# Altium schematic sheet 07 AD9363.SchDoc
size A3
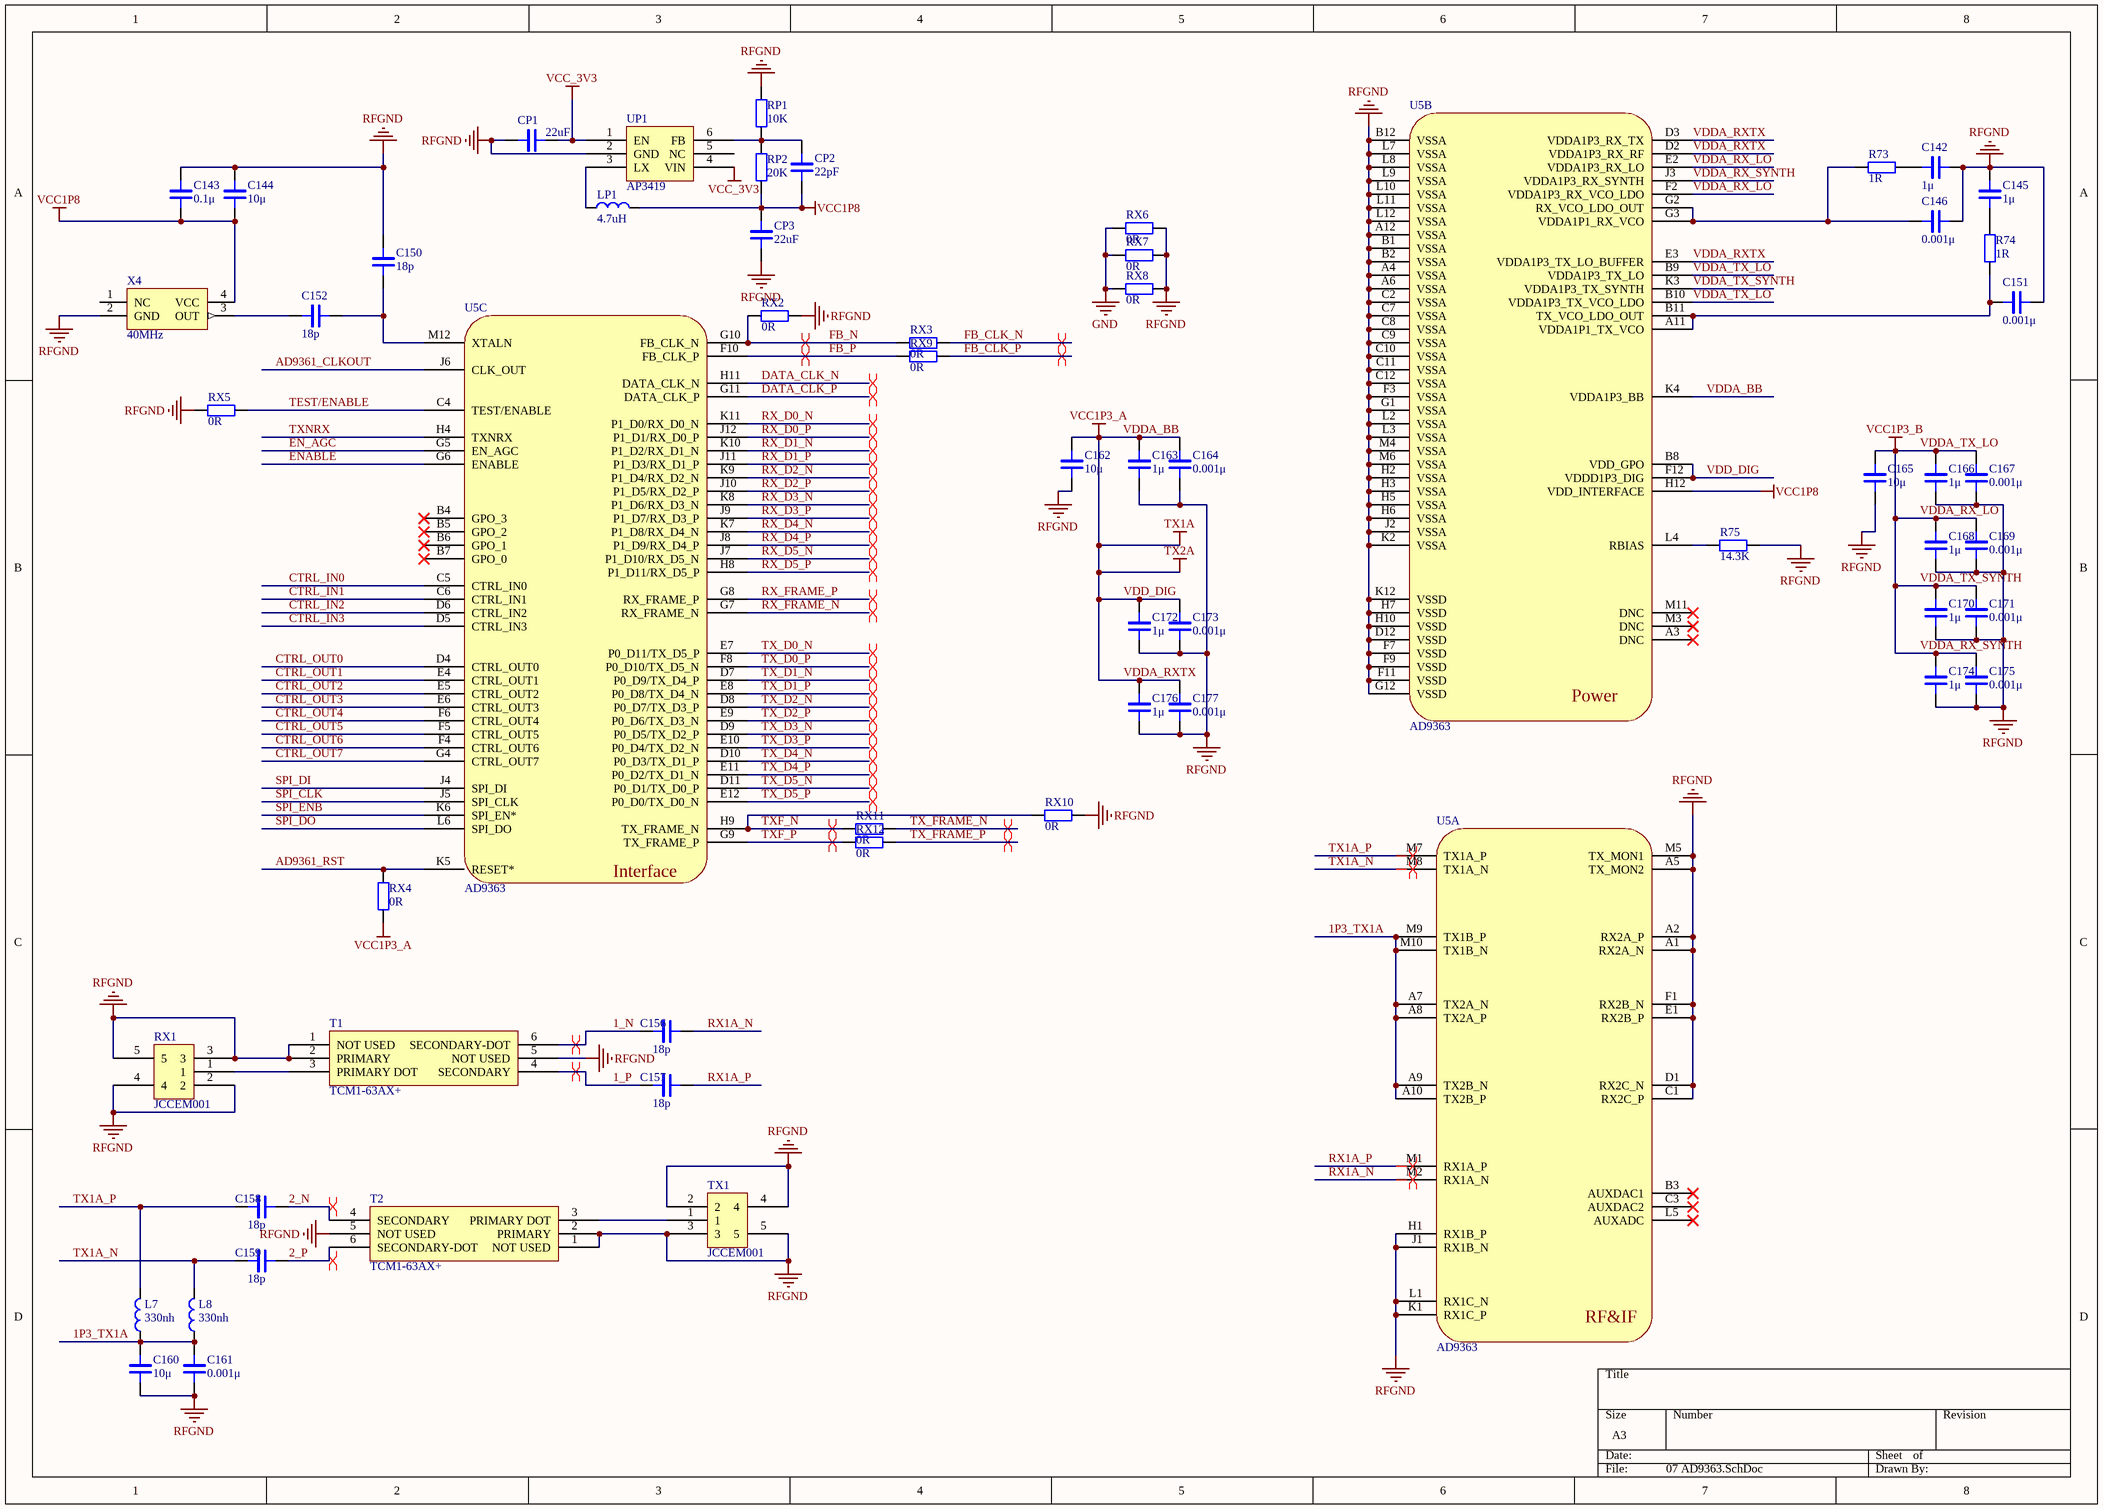
[diagram p0: 07 AD9363.SchDoc]

## Parts
C142  1μ  [LC-0402_C]
C143  0.1μ  [LC-0402_C]
C144  10μ  [LC-0402_C]
C145  1μ  [LC-0402_C]
C146  0.001μ  [LC-0402_C]
C150  18p  [LC-0402_C]
C151  0.001μ  [LC-0402_C]
C152  18p  [LC-0402_C]
C156  18p  [LC-0402_C]
C157  18p  [LC-0402_C]
C158  18p  [LC-0402_C]
C159  18p  [LC-0402_C]
C160  10μ  [LC-0402_C]
C161  0.001μ  [LC-0402_C]
C162  10μ  [LC-0402_C]
C163  1μ  [LC-0402_C]
C164  0.001μ  [LC-0402_C]
C165  10μ  [LC-0402_C]
C166  1μ  [LC-0402_C]
C167  0.001μ  [LC-0402_C]
C168  1μ  [LC-0402_C]
C169  0.001μ  [LC-0402_C]
C170  1μ  [LC-0402_C]
C171  0.001μ  [LC-0402_C]
C172  1μ  [LC-0402_C]
C173  0.001μ  [LC-0402_C]
C174  1μ  [LC-0402_C]
C175  0.001μ  [LC-0402_C]
C176  1μ  [LC-0402_C]
C177  0.001μ  [LC-0402_C]
CP1  22uF  [LC-0805_C]
CP2  22pF  [LC-0402_C]
CP3  22uF  [LC-0805_C]
L7  330nh  [LC-0603_L]
L8  330nh  [LC-0603_L]
LP1  4.7uH  [L1008]
R73  1R  [LC-0402_R]
R74  1R  [LC-0402_R]
R75  14.3K  [LC-0402_R]
RP1  10K  [LC-0402_R]
RP2  20K  [LC-0402_R]
RX1  JCCEM001  [CNSMARAL687W375H171]
RX2  0R  [LC-0402_R]
RX3  0R  [LC-0402_R]
RX4  0R  [LC-0402_R]
RX5  0R  [LC-0402_R]
RX6  0R  [LC-0603_L]
RX7  0R  [LC-0603_L]
RX8  0R  [LC-0603_L]
RX9  0R  [LC-0402_R]
RX10  0R  [LC-0402_R]
RX11  0R  [LC-0402_R]
RX12  0R  [LC-0402_R]
T1  TCM1-63AX+  [TSML150W160H160]
T2  TCM1-63AX+  [TSML150W160H160]
TX1  JCCEM001  [CNSMARAL687W375H171]
U5  AD9363  [AD936X]  (parts A,B,C of 3)
UP1  AP3419  [AP3419]
X4  40MHz  [OSC-SMD_4P-L3.2-W2.5-BL]

## Nets
GND: RX6.2 RX7.2 RX8.2
RFGND: C142.2 C143.1 C144.1 C145.1 C146.1 C150.1 C151.1 C160.2 C161.1 C162.2 C163.2 C164.2 C165.2 C166.2 C167.2 C168.2 C169.2 C170.2 C171.2 C172.2 C173.2 C174.2 C175.2 C176.2 C177.2 CP1.1 CP3.1 R75.2 RP1.2 RX1.2 RX1.3 RX1.4 RX1.5 RX2.1 RX5.1 RX6.1 RX7.1 RX8.1 RX10.1 T1.1(NOT_USED) T1.2(PRIMARY) T1.5(NOT_USED) T2.1(NOT_USED) T2.2(PRIMARY) T2.5(NOT_USED) TX1.2 TX1.3 TX1.4 TX1.5 U5.A1(RX2A_N) U5.A2(RX2A_P) U5.A4(VSSA) U5.A5(TX_MON2) U5.A6(VSSA) U5.A12(VSSA) U5.B1(VSSA) U5.B2(VSSA) U5.B12(VSSA) U5.C1(RX2C_P) U5.C2(VSSA) U5.C7(VSSA) U5.C8(VSSA) U5.C9(VSSA) U5.C10(VSSA) U5.C11(VSSA) U5.C12(VSSA) U5.D1(RX2C_N) U5.D12(VSSD) U5.E1(RX2B_P) U5.F1(RX2B_N) U5.F3(VSSA) U5.F7(VSSD) U5.F9(VSSD) U5.F11(VSSD) U5.G1(VSSA) U5.G12(VSSD) U5.H1(RX1B_P) U5.H2(VSSA) U5.H3(VSSA) U5.H5(VSSA) U5.H6(VSSA) U5.H7(VSSD) U5.H10(VSSD) U5.J1(RX1B_N) U5.J2(VSSA) U5.K1(RX1C_P) U5.K2(VSSA) U5.K12(VSSD) U5.L1(RX1C_N) U5.L2(VSSA) U5.L3(VSSA) U5.L7(VSSA) U5.L8(VSSA) U5.L9(VSSA) U5.L10(VSSA) U5.L11(VSSA) U5.L12(VSSA) U5.M4(VSSA) U5.M5(TX_MON1) U5.M6(VSSA) UP1.2(GND) X4.2(GND)
VCC1P8: C143.2 C144.2 CP2.1 CP3.2 LP1.2 RP2.1 U5.H12(VDD_INTERFACE) X4.4(VCC)
VCC_3V3: CP1.2 UP1.1(EN) UP1.4(VIN)
VDD_DIG: C162.1 C163.1 C164.1 C172.1 C173.1 C176.1 C177.1 RX4.2 U5.B8(VDD_GPO) U5.D2(VDDA1P3_RX_RF) U5.D3(VDDA1P3_RX_TX) U5.E3(VDDA1P3_TX_LO_BUFFER) U5.F12(VDDD1P3_DIG) U5.K4(VDDA1P3_BB)  [also labelled TX1A, TX2A, VCC1P3_A, VDDA_BB, VDDA_RXTX]
VDDA_RX_LO: C165.1 C166.1 C167.1 C168.1 C169.1 C170.1 C171.1 C174.1 C175.1 U5.B9(VDDA1P3_TX_LO) U5.B10(VDDA1P3_TX_VCO_LDO) U5.E2(VDDA1P3_RX_LO) U5.F2(VDDA1P3_RX_VCO_LDO) U5.J3(VDDA1P3_RX_SYNTH) U5.K3(VDDA1P3_TX_SYNTH)  [also labelled VCC1P3_B, VDDA_RX_SYNTH, VDDA_TX_LO, VDDA_TX_SYNTH]
1_N: C156.1 T1.6(SECONDARY-DOT)
1_P: C157.1 T1.4(SECONDARY)
1P3_TX1A: C160.1 C161.2 L7.1 L8.1 U5.A7(TX2A_N) U5.A8(TX2A_P) U5.A9(TX2B_N) U5.A10(TX2B_P) U5.M9(TX1B_P) U5.M10(TX1B_N)
2_N: C158.2 T2.4(SECONDARY)
2_P: C159.2 T2.6(SECONDARY-DOT)
AD9361_CLKOUT: U5.J6(CLK_OUT)
AD9361_RST: RX4.1 U5.K5(RESET*)
CTRL_IN0: U5.C5(CTRL_IN0)
CTRL_IN1: U5.C6(CTRL_IN1)
CTRL_IN2: U5.D6(CTRL_IN2)
CTRL_IN3: U5.D5(CTRL_IN3)
CTRL_OUT0: U5.D4(CTRL_OUT0)
CTRL_OUT1: U5.E4(CTRL_OUT1)
CTRL_OUT2: U5.E5(CTRL_OUT2)
CTRL_OUT3: U5.E6(CTRL_OUT3)
CTRL_OUT4: U5.F6(CTRL_OUT4)
CTRL_OUT5: U5.F5(CTRL_OUT5)
CTRL_OUT6: U5.F4(CTRL_OUT6)
CTRL_OUT7: U5.G4(CTRL_OUT7)
DATA_CLK_N: U5.H11(DATA_CLK_N)
DATA_CLK_P: U5.G11(DATA_CLK_P)
EN_AGC: U5.G5(EN_AGC)
ENABLE: U5.G6(ENABLE)
FB_CLK_N: RX3.1
FB_CLK_P: RX9.1
FB_N: RX2.2 RX3.2 U5.G10(FB_CLK_N)
FB_P: RX9.2 U5.F10(FB_CLK_P)
RX1A_N: C156.2 U5.M2(RX1A_N)
RX1A_P: C157.2 U5.M1(RX1A_P)
RX_D0_N: U5.K11(P1_D0/RX_D0_N)
RX_D0_P: U5.J12(P1_D1/RX_D0_P)
RX_D1_N: U5.K10(P1_D2/RX_D1_N)
RX_D1_P: U5.J11(P1_D3/RX_D1_P)
RX_D2_N: U5.K9(P1_D4/RX_D2_N)
RX_D2_P: U5.J10(P1_D5/RX_D2_P)
RX_D3_N: U5.K8(P1_D6/RX_D3_N)
RX_D3_P: U5.J9(P1_D7/RX_D3_P)
RX_D4_N: U5.K7(P1_D8/RX_D4_N)
RX_D4_P: U5.J8(P1_D9/RX_D4_P)
RX_D5_N: U5.J7(P1_D10/RX_D5_N)
RX_D5_P: U5.H8(P1_D11/RX_D5_P)
RX_FRAME_N: U5.G7(RX_FRAME_N)
RX_FRAME_P: U5.G8(RX_FRAME_P)
SPI_CLK: U5.J5(SPI_CLK)
SPI_DI: U5.J4(SPI_DI)
SPI_DO: U5.L6(SPI_DO)
SPI_ENB: U5.K6(SPI_EN*)
TEST/ENABLE: RX5.2 U5.C4(TEST/ENABLE)
TX1A_N: C159.1 L8.2 U5.M8(TX1A_N)
TX1A_P: C158.1 L7.2 U5.M7(TX1A_P)
TX_D0_N: U5.E7(P0_D11/TX_D5_P)
TX_D0_P: U5.F8(P0_D10/TX_D5_N)
TX_D1_N: U5.D7(P0_D9/TX_D4_P)
TX_D1_P: U5.E8(P0_D8/TX_D4_N)
TX_D2_N: U5.D8(P0_D7/TX_D3_P)
TX_D2_P: U5.E9(P0_D6/TX_D3_N)
TX_D3_N: U5.D9(P0_D5/TX_D2_P)
TX_D3_P: U5.E10(P0_D4/TX_D2_N)
TX_D4_N: U5.D10(P0_D3/TX_D1_P)
TX_D4_P: U5.E11(P0_D2/TX_D1_N)
TX_D5_N: U5.D11(P0_D1/TX_D0_P)
TX_D5_P: U5.E12(P0_D0/TX_D0_N)
TX_FRAME_N: RX11.1
TX_FRAME_P: RX12.1
TXF_N: RX10.2 RX11.2 U5.H9(TX_FRAME_N)
TXF_P: RX12.2 U5.G9(TX_FRAME_P)
TXNRX: U5.H4(TXNRX)
NetC142_1: C142.1 R73.2
NetC145_2: C145.2 R74.1
NetC146_2: C146.2 R73.1 U5.G2(RX_VCO_LDO_OUT) U5.G3(VDDA1P1_RX_VCO)
NetC150_2: C150.2 C152.1 U5.M12(XTALN)
NetC151_2: C151.2 R74.2 U5.A11(VDDA1P1_TX_VCO) U5.B11(TX_VCO_LDO_OUT)
NetC152_2: C152.2 X4.3(OUT)
NetCP2_2: CP2.2 RP1.1 RP2.2 UP1.6(FB)
NetLP1_1: LP1.1 UP1.3(LX)
NetR75_1: R75.1 U5.L4(RBIAS)
NetRX1_1: RX1.1 T1.3(PRIMARY_DOT)
NetT2_3: T2.3(PRIMARY_DOT) TX1.1

Not connected (* = marked no-connect by the designer): U5 A3(DNC)* B3(AUXDAC1)* B4(GPO_3)* B5(GPO_2)* B6(GPO_1)* B7(GPO_0)* C3(AUXDAC2)* L5(AUXADC)* M3(DNC)* M11(DNC)*; UP1 5(NC); X4 1(NC)

## Layout directives
differential pair: 1_N, 1_P, 2_N, 2_P, DATA_CLK_N, DATA_CLK_P, FB_CLK_N, FB_CLK_P, FB_N, FB_P, RX1A_N, RX1A_P, RX_D0_N, RX_D0_P, RX_D1_N, RX_D1_P, RX_D2_N, RX_D2_P, RX_D3_N, RX_D3_P, RX_D4_N, RX_D4_P, RX_D5_N, RX_D5_P, RX_FRAME_N, RX_FRAME_P, TX1A_N, TX1A_P, TX_D0_N, TX_D0_P, TX_D1_N, TX_D1_P, TX_D2_N, TX_D2_P, TX_D3_N, TX_D3_P, TX_D4_N, TX_D4_P, TX_D5_N, TX_D5_P, TX_FRAME_N, TX_FRAME_P, TXF_N, TXF_P

## Notes on the sheet
- (in symbol AD9363, part A) RF&IF
- (in symbol AD9363, part B) Power
- (in symbol AD9363, part C) Interface

## Library data of the parts
C142-C144 C160 C161 CP2 = CAP_2: Capacitor
C145 C146 C150-C152 C156-C159 C162-C177 CP1 CP3 = CAP_1: Capacitor
L7 L8 LP1 = INDUCTANCE
R73-R75 RP1 RP2 RX2-RX12 = RES_1: Resistor
X4 = XTAL-4: Oscillator